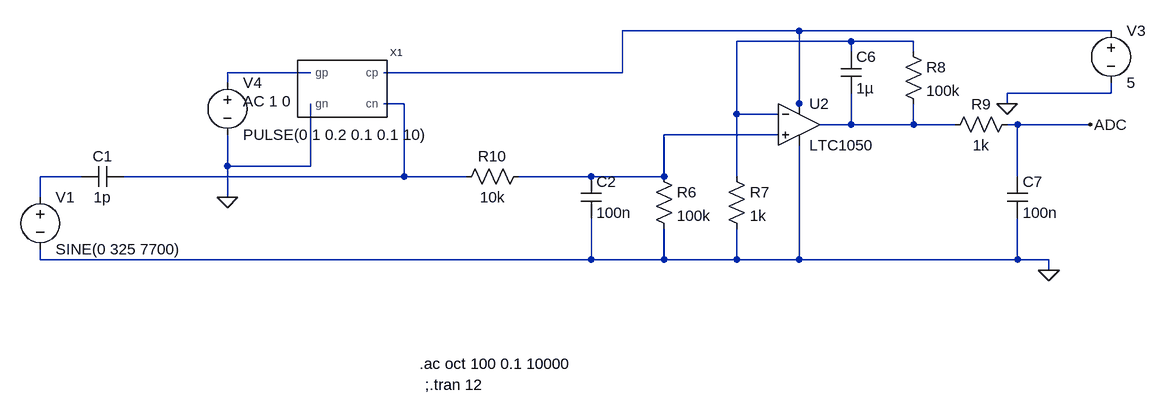
[diagram p0: schematic Test_efficacite-filtres_&_frequence-Nyquist.asc]
Test_efficacite-filtres_&_frequence-Nyquist.asc, the LTspice schematic file:
Version 4
SHEET 1 880 680
WIRE 272 -528 0 -528
WIRE 752 -528 272 -528
WIRE 352 -512 176 -512
WIRE 448 -512 352 -512
WIRE 352 -496 352 -512
WIRE 448 -496 448 -512
WIRE -480 -464 -608 -464
WIRE 0 -464 0 -528
WIRE 0 -464 -368 -464
WIRE -608 -448 -608 -464
WIRE 752 -432 752 -448
WIRE 752 -432 592 -432
WIRE -336 -416 -368 -416
WIRE 272 -416 272 -528
WIRE 592 -416 592 -432
WIRE 176 -400 176 -512
WIRE 240 -400 176 -400
WIRE 272 -400 272 -416
WIRE 352 -384 352 -432
WIRE 352 -384 304 -384
WIRE 448 -384 448 -416
WIRE 448 -384 352 -384
WIRE 512 -384 448 -384
WIRE 608 -384 592 -384
WIRE 720 -384 608 -384
WIRE 240 -368 64 -368
WIRE -608 -320 -608 -368
WIRE -480 -320 -480 -416
WIRE -480 -320 -608 -320
WIRE -832 -304 -896 -304
WIRE -336 -304 -336 -416
WIRE -336 -304 -768 -304
WIRE -240 -304 -336 -304
WIRE -48 -304 -160 -304
WIRE 64 -304 64 -368
WIRE 64 -304 -48 -304
WIRE 176 -304 176 -400
WIRE 608 -304 608 -384
WIRE -896 -272 -896 -304
WIRE -608 -272 -608 -320
WIRE -896 -176 -896 -192
WIRE -48 -176 -48 -240
WIRE -48 -176 -896 -176
WIRE 64 -176 64 -224
WIRE 64 -176 -48 -176
WIRE 176 -176 176 -224
WIRE 176 -176 64 -176
WIRE 272 -176 272 -352
WIRE 272 -176 176 -176
WIRE 608 -176 608 -240
WIRE 608 -176 272 -176
WIRE 656 -176 608 -176
WIRE 656 -160 656 -176
FLAG 656 -160 0
FLAG 592 -416 0
FLAG 720 -384 ADC
FLAG -608 -272 0
SYMBOL res 48 -320 R0
SYMATTR InstName R6
SYMATTR Value 100k
SYMBOL res 160 -320 R0
SYMATTR InstName R7
SYMATTR Value 1k
SYMBOL res 432 -512 R0
SYMATTR InstName R8
SYMATTR Value 100k
SYMBOL cap -64 -304 R0
SYMATTR InstName C2
SYMATTR Value 100n
SYMBOL cap 336 -496 R0
SYMATTR InstName C6
SYMATTR Value 1µ
SYMBOL cap 592 -304 R0
SYMATTR InstName C7
SYMATTR Value 100n
SYMBOL OpAmps\\LTC1050 272 -448 R0
SYMATTR InstName U2
SYMBOL res 608 -400 R90
WINDOW 0 0 56 VBottom 2
WINDOW 3 32 56 VTop 2
SYMATTR InstName R9
SYMATTR Value 1k
SYMBOL voltage 752 -544 R0
WINDOW 123 0 0 Left 0
WINDOW 39 0 0 Left 0
SYMATTR InstName V3
SYMATTR Value 5
SYMBOL res -144 -320 R90
WINDOW 0 0 56 VBottom 2
WINDOW 3 32 56 VTop 2
SYMATTR InstName R10
SYMATTR Value 10k
SYMBOL Projet2 -448 -432 R0
SYMATTR InstName X1
SYMBOL voltage -608 -464 R0
WINDOW 123 24 44 Left 2
WINDOW 39 0 0 Left 0
SYMATTR Value2 AC 1 0
SYMATTR InstName V4
SYMATTR Value PULSE(0 1 0.2 0.1 0.1 10)
SYMBOL cap -768 -320 R90
WINDOW 0 0 32 VBottom 2
WINDOW 3 32 32 VTop 2
SYMATTR InstName C1
SYMATTR Value 1p
SYMBOL voltage -896 -288 R0
WINDOW 123 0 0 Left 0
WINDOW 39 0 0 Left 0
SYMATTR InstName V1
SYMATTR Value SINE(0 325 7700)
TEXT -304 16 Left 2 !;.tran 12
TEXT -312 -16 Left 2 !.ac oct 100 0.1 10000

The netlist it stands for:
* Test_efficacite-filtres_&_frequence-Nyquist.asc
R6 N006 0 100k
R7 N002 0 1k
R8 N002 N005 100k
C2 N006 0 100n
C6 N002 N005 1µ
C7 ADC 0 100n
XU2 N006 N002 N001 0 N005 LTC1050  ; pins In+ In- V+ V- OUT
R9 ADC N005 1k
V3 N001 0 5
R10 N006 N004 10k
XX1 N001 N004 N003 0 Projet2  ; pins cp cn gp gn
V4 N003 0 PULSE(0 1 0.2 0.1 0.1 10) AC 1 0
C1 N004 N007 1p
V1 N007 0 SINE(0 325 7700)
;.tran 12
.ac oct 100 0.1 10000
.lib LTC.lib
.backanno
.end